# Altium project xmc-RG.PrjPCB
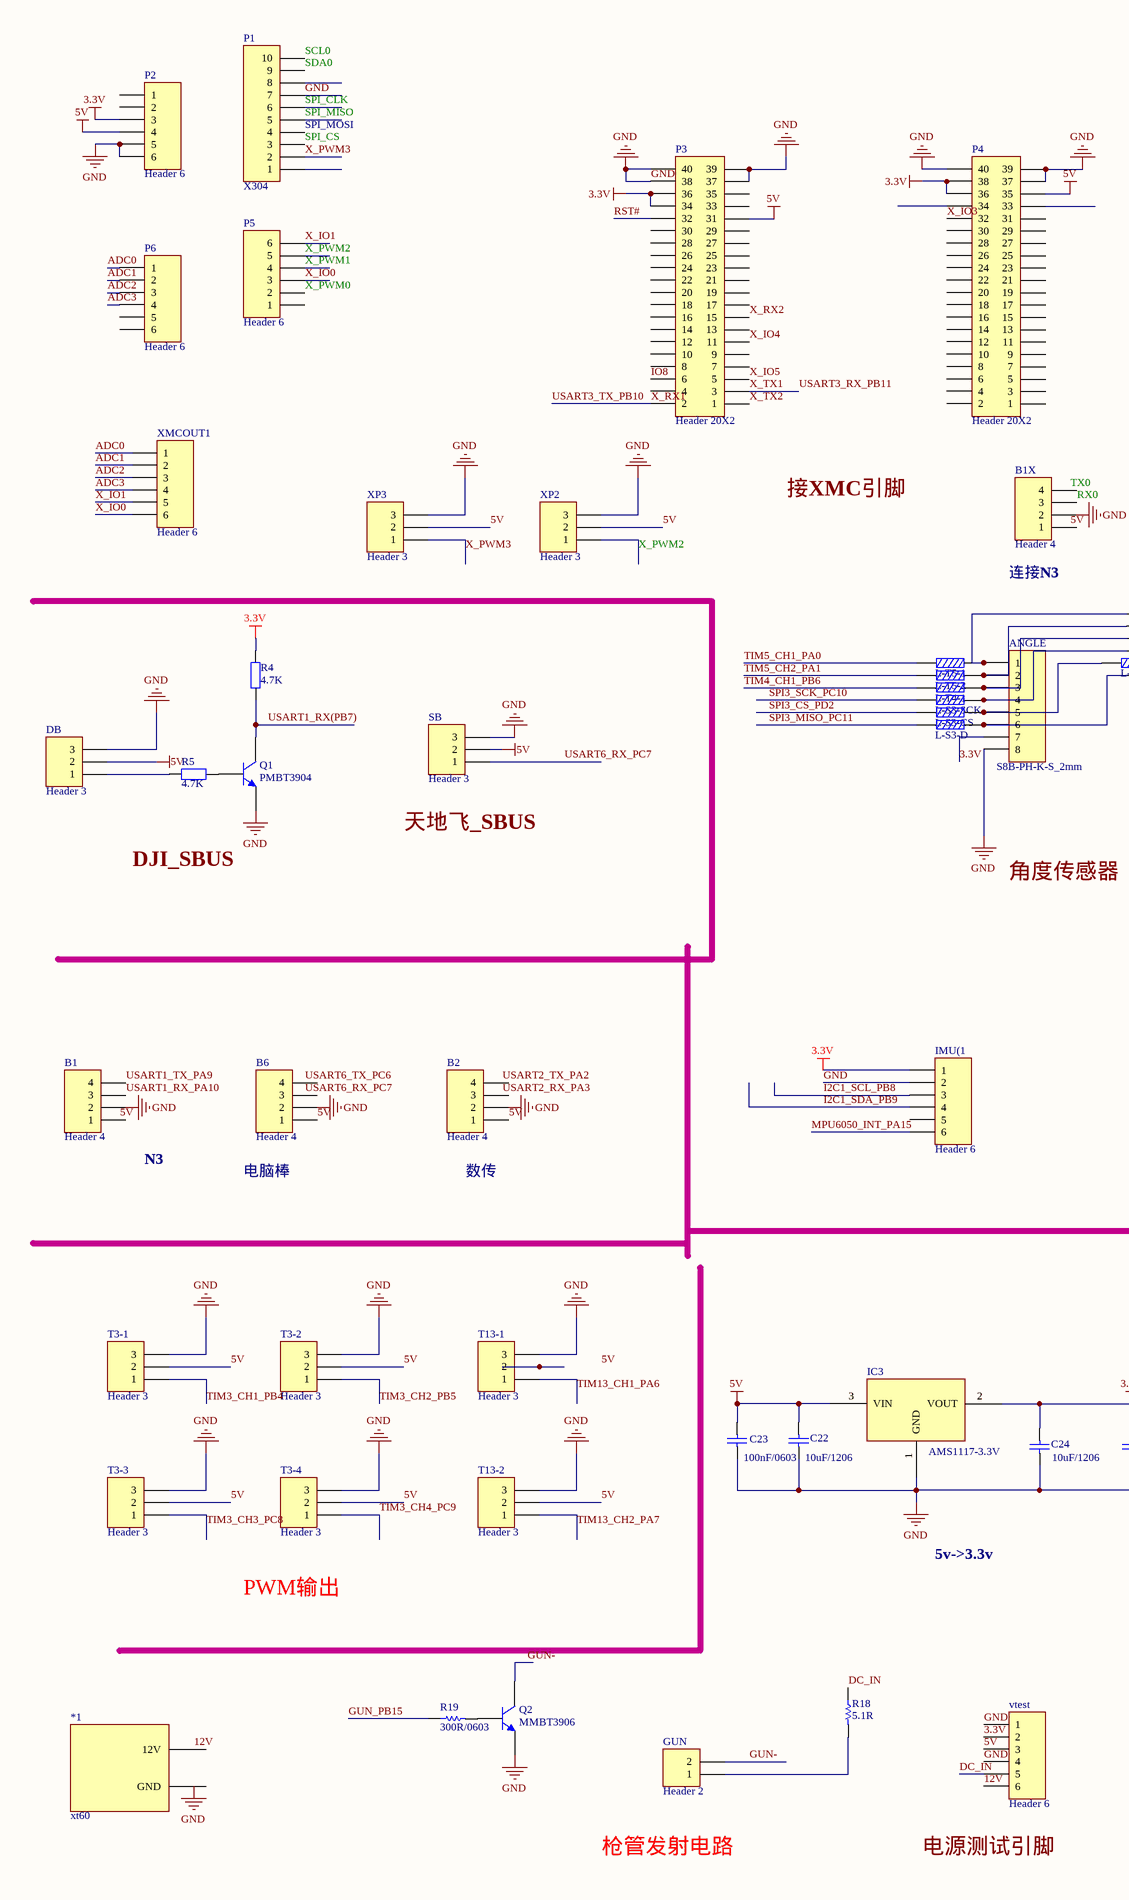
[diagram p0: XMCextern-RG-4_4.SchDoc, left]
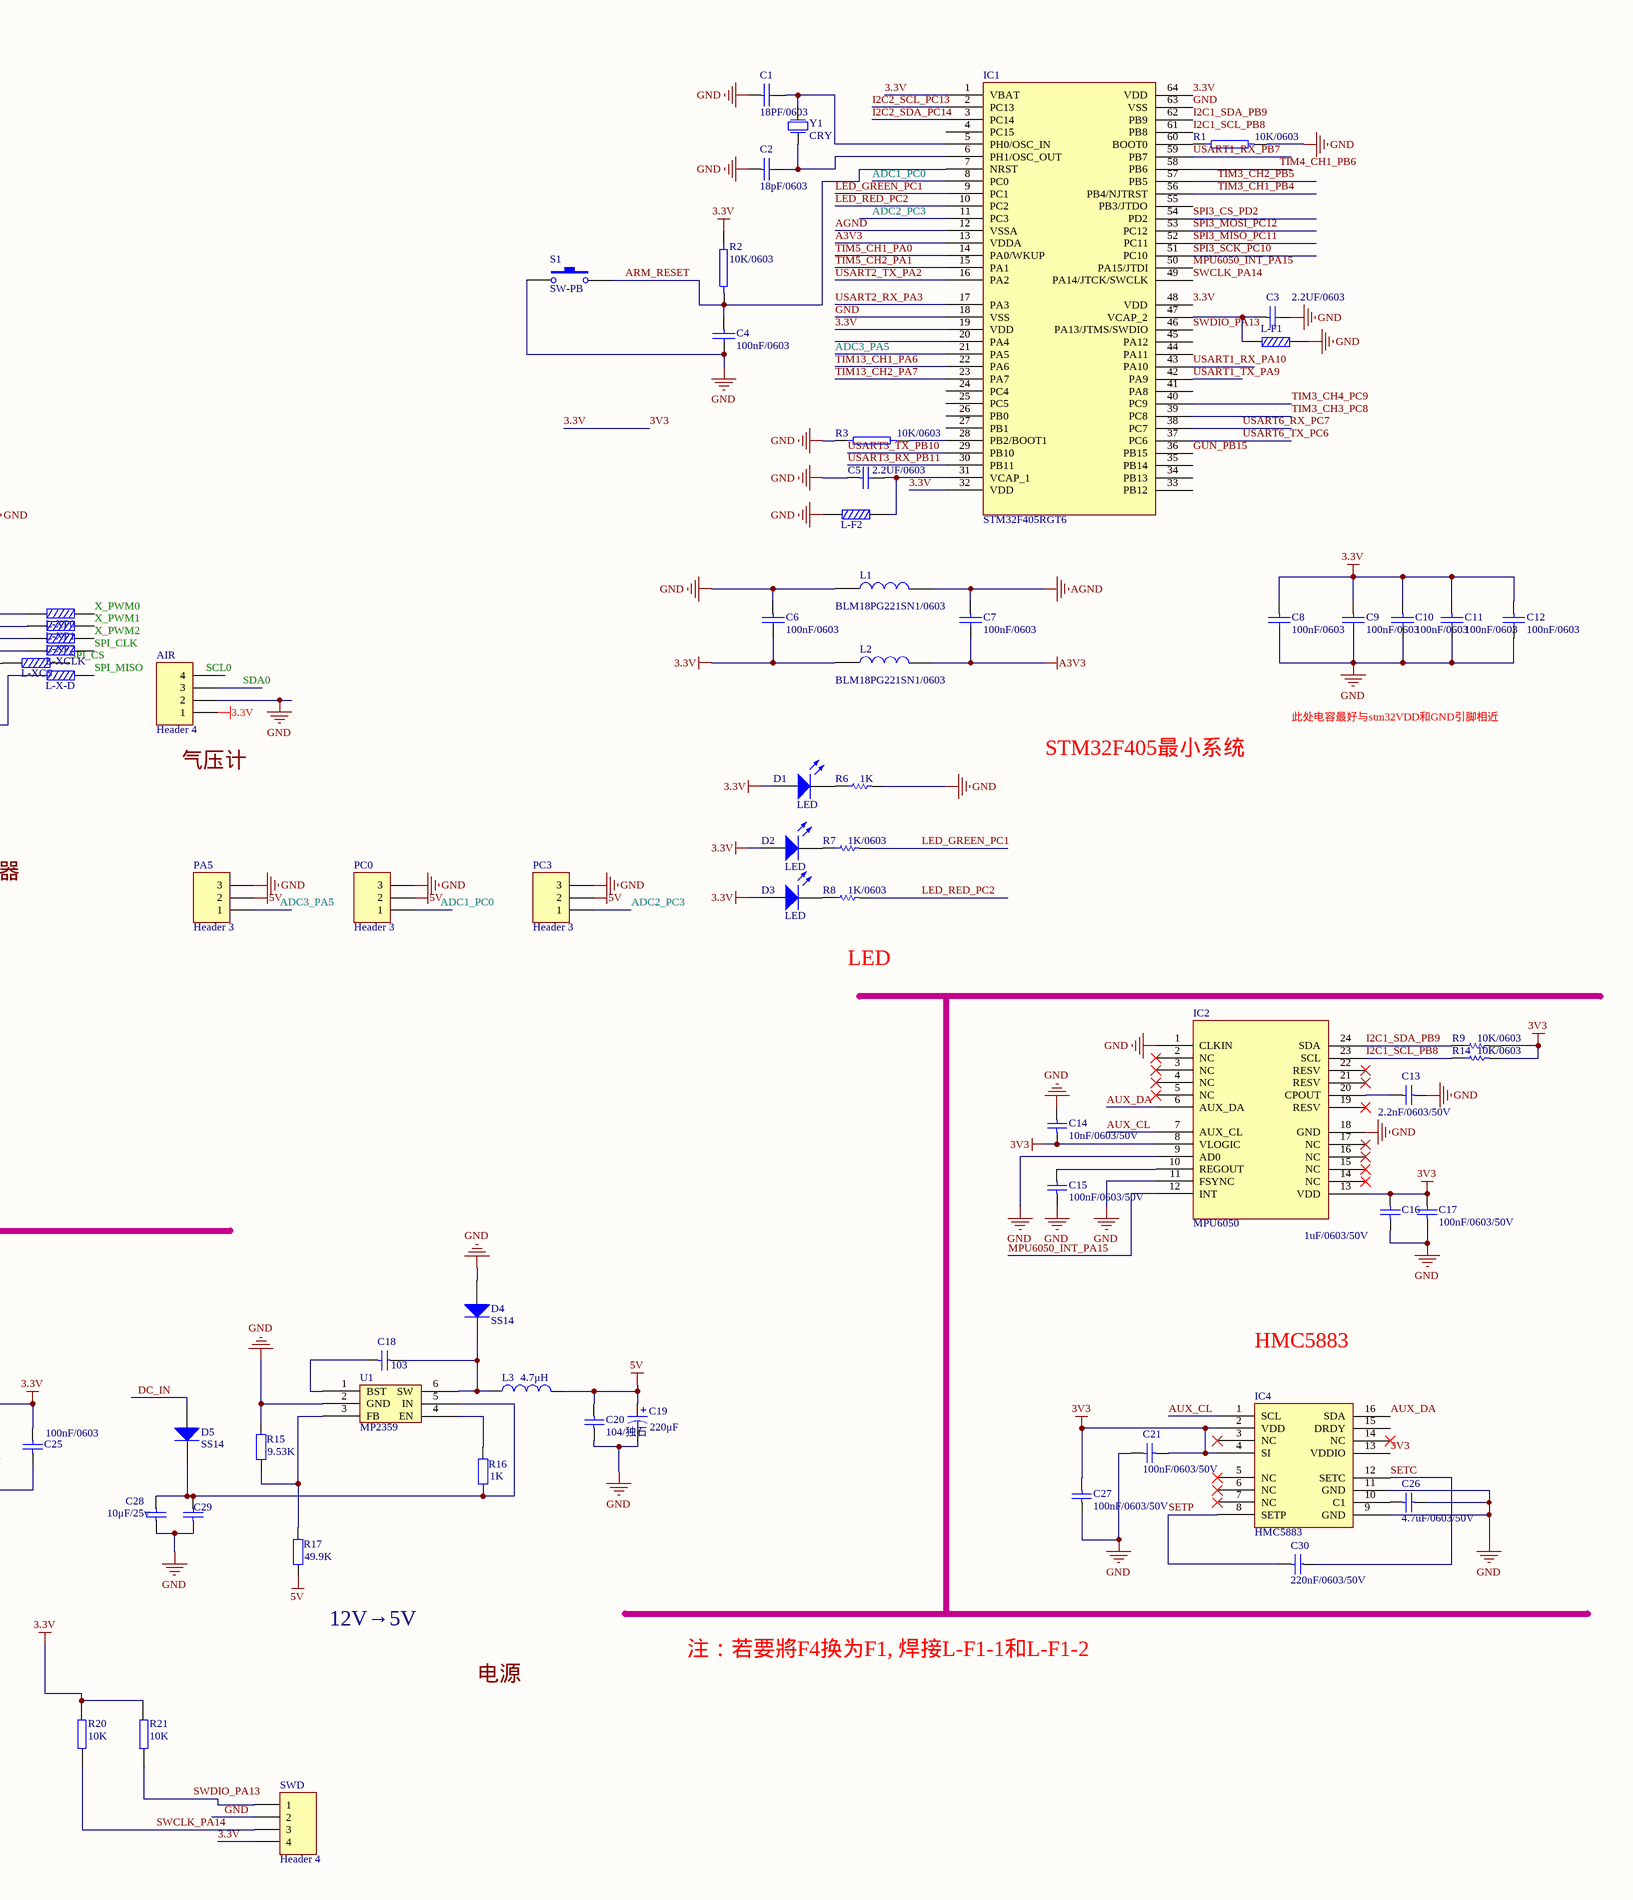
[diagram p1: XMCextern-RG-4_4.SchDoc, right]
1 sheet, 109 parts. Net scope: global (net labels, ports and power ports of the same name join across sheets).
Board file: XMC-RG.PcbDoc

## Sheet XMCextern-RG-4_4.SchDoc
size A2

### Parts
*1  xt60  [XT60]
AIR  Header 4  [HDR1X4]
ANGLE  S8B-PH-K-S_2mm  [PH_2MM_8PIN]
B1  Header 4  [HDR1X4]
B1X  Header 4  [HDR1X4]
B2  Header 4  [HDR1X4]
B6  Header 4  [HDR1X4]
C1  18PF/0603  [0603C]
C2  18pF/0603  [0603C]
C3  2.2UF/0603  [0603C]
C4  100nF/0603  [0603C]
C5  2.2UF/0603  [0603C]
C6  100nF/0603  [0603C]
C7  100nF/0603  [0603C]
C8  100nF/0603  [0603C]
C9  100nF/0603  [0603C]
C10  100nF/0603  [0603C]
C11  100nF/0603  [0603C]
C12  100nF/0603  [0603C]
C13  2.2nF/0603/50V  [0603C]
C14  10nF/0603/50V  [0603C]
C15  100nF/0603/50V  [0603C]
C16  1uF/0603/50V  [0603C]
C17  100nF/0603/50V  [0603C]
C18  value 103  [0805]  (hidden comment: Cap)
C19  220μF  [电解电容330uf，470uf]
C20  value 104/独石  [LC-0805_C]  (hidden comment: 104)
C21  100nF/0603/50V  [0603C]
C22  10uF/1206  [1206]
C23  100nF/0603  [0603]
C24  10uF/1206  [1206]
C25  100nF/0603  [0603]
C26  4.7uF/0603/50V  [0603C]
C27  100nF/0603/50V  [0603C]
C28  10μF/25v  [0805]
C29  Altium Limited  [0805]  (value not drawn)
C30  220nF/0603/50V  [0603C]
D1  LED  [0603D]
D2  LED  [0603D]
D3  LED  [0603D]
D4  SS14  [SS14]
D5  SS14  [SS14]
DB  Header 3  [HDR1X3]
GUN  Header 2  [HDR1X2]
IC1  STM32F405RGT6  [LQFP64_N]
IC2  MPU6050  [QFN-24N-MPU6050]  (no BOM)
IC3  AMS1117-3.3V  [SOT223-AMS1117]
IC4  HMC5883  [HMC5883]  (no BOM)
IMU(1  Header 6  [HDR1X6]  (no BOM)
L1  BLM18PG221SN1/0603  [0603L]
L2  BLM18PG221SN1/0603  [0603L]
L3  4.7μH  [4.7uh]
L-F1  L  [0805]  (value not drawn)  (no BOM)
L-F2  L  [0805]  (value not drawn)  (no BOM)
L-S3-CS  L  [0805]  (value not drawn)  (no BOM)
L-S3-D  L  [0805]  (value not drawn)  (no BOM)
L-S3-SCK  L  [0805]  (value not drawn)  (no BOM)
L-T4-1  L  [0805]  (value not drawn)  (no BOM)
L-T5-1  L  [0805]  (value not drawn)  (no BOM)
L-T5-2  L  [0805]  (value not drawn)  (no BOM)
L-X-D  L  [0805]  (value not drawn)  (no BOM)
L-XCLK  L  [0805]  (value not drawn)  (no BOM)
L-XCS  L  [0805]  (value not drawn)  (no BOM)
L-XP0  L  [0805]  (value not drawn)  (no BOM)
L-XP1  L  [0805]  (value not drawn)  (no BOM)
L-XP2  L  [0805]  (value not drawn)  (no BOM)
P1  X304  [HDR1X10]
P2  Header 6  [HDR1X6]
P3  Header 20X2  [HDR2X20]
P4  Header 20X2  [HDR2X20]
P5  Header 6  [HDR1X6]
P6  Header 6  [HDR1X6]
PA5  Header 3  [HDR1X3]
PC0  Header 3  [HDR1X3]
PC3  Header 3  [HDR1X3]
Q1  PMBT3904  [LC-SOT-23(SOT-23-3)]
Q2  MMBT3906  [sot23]
R1  10K/0603  [0603r]
R2  10K/0603  [0603R]
R3  10K/0603  [0603r]
R4  4.7K  [0603]
R5  4.7K  [0603]
R6  1K  [0603R]
R7  1K/0603  [0603R]
R8  1K/0603  [0603R]
R9  10K/0603  [0603]
R14  10K/0603  [0603]
R15  9.53K  [0805]
R16  1K  [0805]
R17  49.9K  [0805]
R18  5.1R  [0603]
R19  300R/0603  [0603]
R20  10K  [0805]
R21  10K  [0805]
S1  SW-PB  [SW_6*6*5]
SB  Header 3  [HDR1X3]
SWD  Header 4  [HDR1X4]  (no BOM)
T3-1  Header 3  [HDR1X3]
T3-2  Header 3  [HDR1X3]
T3-3  Header 3  [HDR1X3]
T3-4  Header 3  [HDR1X3]
T13-1  Header 3  [HDR1X3]
T13-2  Header 3  [HDR1X3]
U1  MP2359  [mp2359]
vtest  Header 6  [HDR1X6]
XMCOUT1  Header 6  [HDR1X6]  (no BOM)
XP2  Header 3  [HDR1X3]
XP3  Header 3  [HDR1X3]
Y1  CRY  [XTAL_5032]

### Nets
3.3V: AIR.1 ANGLE.7 C6.2 C8.1 C9.1 C10.1 C11.1 C12.1 C14.1 C16.2 C17.2 C21.2 C24.2 C25.2 C27.2 D1.1(A) D2.1(A) D3.1(A) IC1.1(VBAT) IC1.19(VDD) IC1.32(VDD) IC1.48(VDD) IC1.64(VDD) IC2.8(VLOGIC) IC2.13(VDD) IC3.2(VOUT) IC4.2(VDD) IC4.4(SI) IC4.13(VDDIO) IMU(1.1 L2.1 P2.3 P3.34 P3.36 P4.36 P4.38 R2.2 R4.1 R9.2 R14.2 R20.2 R21.2 SWD.4 vtest.2  [also labelled 3V3]
5V: B2.1 B6.1 C19.1 C20.1 C22.2 C23.2 DB.2 IC3.3(VIN) L3.2 P2.4 P3.31 P4.35 PA5.2 PC0.2 PC3.2 R17.1 SB.2 T3-1.2 T3-2.2 T3-3.2 T3-4.2 T13-2.2 vtest.3 XP2.2 XP3.2
A3V3: C7.2 IC1.13(VDDA) L2.2
AGND: C7.1 IC1.12(VSSA) L1.2
GND: AIR.2 ANGLE.8 B1.2 B1X.2 B2.2 B6.2 C1.1 C2.1 C3.2 C4.2 C5.1 C6.1 C8.2 C9.2 C10.2 C11.2 C12.2 C13.2 C14.2 C15.1 C16.1 C17.1 C19.2 C20.2 C21.1 C22.1 C23.1 C24.1 C25.1 C26.2 C27.1 C28.2 C29.2 D4.1(A) DB.3 IC1.18(VSS) IC1.63(VSS) IC2.1(CLKIN) IC2.9(AD0) IC2.11(FSYNC) IC2.18(GND) IC3.1(GND) IC4.9(GND) IC4.11(GND) IMU(1.2 L1.1 L-F1.2 L-F2.2 P1.7 P2.5 P2.6 P3.37 P3.38 P3.39 P3.40 P4.37 P4.39 P4.40 PA5.3 PC0.3 PC3.3 Q1.3(E) Q2.2(E) R1.1 R3.2 R6.2 R15.2 S1.1 SB.3 SWD.2 T3-1.3 T3-2.3 T3-3.3 T3-4.3 T13-1.3 T13-2.3 U1.2(GND) vtest.1 vtest.4 XP2.3 XP3.3
12V: vtest.6
ADC0: P6.1 XMCOUT1.1
ADC1: P6.2 XMCOUT1.2
ADC1_PC0: IC1.8(PC0) PC0.1
ADC2: P6.3 XMCOUT1.3
ADC2_PC3: IC1.11(PC3) PC3.1
ADC3: P6.4 XMCOUT1.4
ADC3_PA5: IC1.21(PA5) PA5.1
ARM_RESET: C4.1 IC1.7(NRST) R2.1 S1.2
AUX_CL: IC2.7(AUX_CL) IC4.1(SCL)
AUX_DA: IC2.6(AUX_DA) IC4.16(SDA)
DC_IN: D5.1(A) R18.1 vtest.5
GUN-: GUN.2 Q2.3(C)
GUN_PB15: IC1.36(PB15) R19.1
I2C1_SCL_PB8: IC1.61(PB8) IC2.23(SCL) IMU(1.3 R14.1
I2C1_SDA_PB9: IC1.62(PB9) IC2.24(SDA) IMU(1.4 R9.1
I2C2_SCL_PC13: IC1.2(PC13)
I2C2_SDA_PC14: IC1.3(PC14)
IO8: P3.6
LED_GREEN_PC1: IC1.9(PC1) R7.2
LED_RED_PC2: IC1.10(PC2) R8.2
MPU6050_INT_PA15: IC1.50(PA15/JTDI) IC2.12(INT) IMU(1.6
RST#: P3.32
RX0: B1X.3
SCL0: P1.10
SDA0: AIR.3 P1.9
SETC: C30.2 IC4.12(SETC)
SETP: C30.1 IC4.8(SETP)
SPI3_CS_PD2: IC1.54(PD2) L-S3-CS.2
SPI3_MISO_PC11: IC1.52(PC11) L-S3-D.2
SPI3_MOSI_PC12: IC1.53(PC12)
SPI3_SCK_PC10: IC1.51(PC10) L-S3-SCK.2
SPI_CLK: L-XCLK.1 P1.6
SPI_CS: L-XCS.1 P1.3
SPI_MISO: L-X-D.1 P1.5
SPI_MOSI: P1.4
SWCLK_PA14: IC1.49(PA14/JTCK/SWCLK) R20.1 SWD.3
SWDIO_PA13: IC1.46(PA13/JTMS/SWDIO) R21.1 SWD.1
TIM3_CH1_PB4: IC1.56(PB4/NJTRST) T3-1.1
TIM3_CH2_PB5: IC1.57(PB5) T3-2.1
TIM3_CH3_PC8: IC1.39(PC8) T3-3.1
TIM3_CH4_PC9: IC1.40(PC9) T3-4.1
TIM4_CH1_PB6: IC1.58(PB6) L-T4-1.2
TIM5_CH1_PA0: IC1.14(PA0/WKUP) L-T5-1.2
TIM5_CH2_PA1: IC1.15(PA1) L-T5-2.2
TIM13_CH1_PA6: IC1.22(PA6) T13-1.1
TIM13_CH2_PA7: IC1.23(PA7) T13-2.1
USART1_RX(PB7): Q1.1(C) R4.2
USART1_RX_PA10: B1.3 IC1.43(PA10)
USART1_RX_PB7: IC1.59(PB7)
USART1_TX_PA9: B1.4 IC1.42(PA9)
USART2_RX_PA3: IC1.17(PA3)
USART2_TX_PA2: IC1.16(PA2)
USART3_RX_PB11: IC1.30(PB11) P3.3  [also labelled X_TX1]
USART3_TX_PB10: IC1.29(PB10) P3.2  [also labelled X_RX1]
USART6_RX_PC7: IC1.38(PC7) SB.1
USART6_TX_PC6: IC1.37(PC6)
X_IO0: P5.3 XMCOUT1.6
X_IO1: P5.6 XMCOUT1.5
X_IO3: P4.32
X_IO4: P3.11
X_IO5: P3.5
X_PWM0: L-XP0.1 P5.2
X_PWM1: L-XP1.1 P5.4
X_PWM2: L-XP2.1 P5.5 XP2.1
X_PWM3: P1.2 XP3.1
X_RX2: P3.15
X_TX2: P3.1
NetANGLE_1: ANGLE.1 L-T5-1.1 L-XP0.2
NetANGLE_2: ANGLE.2 L-T5-2.1 L-XP1.2
NetANGLE_3: ANGLE.3 L-T4-1.1 L-XP2.2
NetANGLE_4: ANGLE.4 L-S3-SCK.1 L-XCLK.2
NetANGLE_5: ANGLE.5 L-S3-CS.1 L-XCS.2
NetANGLE_6: ANGLE.6 L-S3-D.1 L-X-D.2
NetC1_2: C1.2 IC1.5(PH0/OSC_IN) Y1.2(P2)
NetC2_2: C2.2 IC1.6(PH1/OSC_OUT) Y1.1(P1)
NetC3_1: C3.1 IC1.47(VCAP_2) L-F1.1
NetC5_2: C5.2 IC1.31(VCAP_1) L-F2.1
NetC13_1: C13.1 IC2.20(CPOUT)
NetC15_2: C15.2 IC2.10(REGOUT)
NetC18_1: C18.1 D4.2(K) L3.1 U1.6(SW)
NetC18_2: C18.2 U1.1(BST)
NetC26_1: C26.1 IC4.10(C1)
NetC28_1: C28.1 C29.1 D5.2(K) R16.1 U1.5(IN)
NetD1_2: D1.2(K) R6.1
NetD2_2: D2.2(K) R7.1
NetD3_2: D3.2(K) R8.1
NetDB_1: DB.1 R5.1
NetGUN_1: GUN.1 R18.2
NetIC1_28: IC1.28(PB2/BOOT1) R3.1
NetIC1_60: IC1.60(BOOT0) R1.2
NetQ1_2: Q1.2(B) R5.2
NetQ2_1: Q2.1(B) R19.2
NetR15_1: R15.1 R17.2 U1.3(FB)
NetR16_2: R16.2 U1.4(EN)

Not connected (* = marked no-connect by the designer): *1 46(12V) 47(GND); AIR 4; B1 1; B1X 1 4; B2 3 4; B6 3 4; IC1 4(PC15) 20(PA4) 24(PC4) 25(PC5) 26(PB0) 27(PB1) 33(PB12) 34(PB13) 35(PB14) 41(PA8) 44(PA11) 45(PA12) 55(PB3/JTDO); IC2 2(NC)* 3(NC)* 4(NC)* 5(NC)* 14(NC)* 15(NC)* 16(NC)* 17(NC)* 19(RESV)* 21(RESV)* 22(RESV)*; IC4 3(NC)* 5(NC)* 6(NC)* 7(NC)* 14(NC)* 15(DRDY); IMU(1 5; P1 1 8; P2 1 2; P3 4 7 8 9 10 12 13 14 16 17 18 19 20 21 22 23 24 25 26 27 28 29 30 33 35; P4 1 2 3 4 5 6 7 8 9 10 11 12 13 14 15 16 17 18 19 20 21 22 23 24 25 26 27 28 29 30 31 33 34; P5 1; P6 5 6; T13-1 2

### Notes on the sheet
- 接XMC引脚
- (near B1X) 连接N3
- (near AIR) 气压计
- STM32F405最小系统
- 此处电容最好与stm32VDD和GND引脚相近
- 天地飞_SBUS
- DJI_SBUS
- 角度传感器
- LED
- N3
- 电脑棒
- (near B2) 数传
- HMC5883
- 5v->3.3v
- PWM输出
- 12V→5V
- 电源
- 注：若要將F4换为F1, 焊接L-F1-1和L-F1-2
- 枪管发射电路
- 电源测试引脚
- Labels drawn without touching a wire or pin: 5V, 12V, GND, SCL0, TX0, USART2_RX_PA3, USART2_TX_PA2, USART6_RX_PC7, USART6_TX_PC6
- Title
- Size:
- Date:
- File:
- A2
- Number:
- Time:
- Revision:
- Sheet
- of

### Library data of the parts
AIR B1 B1X B2 B6 SWD = Header 4: Header, 4-Pin; LatestRevisionDate: 17-Jul-2002; LatestRevisionNote: Re-released for DXP Platform.; Publisher: Altium Limited
ANGLE = MHDR1X8: Header, 8-Pin; LatestRevisionDate: 17-Jul-2002; LatestRevisionNote: Re-released for DXP Platform.; Publisher: Altium Limited
C1-C12 = CAP1
C13-C17 C21-C27 C30 = Cap: Capacitor; Value: 100pF; Published: 8-Jun-2000; LatestRevisionDate: 17-Jul-2002; LatestRevisionNote: Re-released for DXP Platform.; PackageReference: RAD-0.3; Publisher: Altium Limited; PackageDescription: Radial Cap, Thru-Hole; 2 Leads; 0.3 in Pin Spacing
C18 C20 C28 C29 = Cap: Capacitor; Published: 8-Jun-2000; LatestRevisionDate: 17-Jul-2002; LatestRevisionNote: Re-released for DXP Platform.; PackageReference: RAD-0.3; Publisher: Altium Limited
  C28: Value: 10μF/25v
C19 = Cap Pol1: Polarized Capacitor (Radial); Published: 8-Jun-2000; LatestRevisionDate: 17-Jul-2002; LatestRevisionNote: Re-released for DXP Platform.; PackageReference: RB7.6-15; Publisher: Altium Limited; Value: 220μF
D1-D3 = LED2: Typical RED, GREEN, YELLOW, AMBER GaAs LED; Published: 8-Jun-2000; LatestRevisionDate: 17-Jul-2002; LatestRevisionNote: Re-released for DXP Platform.; PackageVersion: Feb-2002; PackageReference: 3.2X1.6X1.1; Publisher: Altium Limited; PackageDescription: SM LED; 2 Flat Leads
D4 D5 = Diode: Default Diode; Published: 8-Jun-2000; LatestRevisionDate: 17-Jul-2002; LatestRevisionNote: Re-released for DXP Platform.; PackageDocument: Sep-1996; PackageReference: SMC; Publisher: Altium Limited; Code_JEDEC: DO-214-AB
DB PA5 PC0 PC3 SB T3-1-T3-4 T13-1 T13-2 XP2 XP3 = Header 3: Header, 3-Pin; LatestRevisionDate: 17-Jul-2002; LatestRevisionNote: Re-released for DXP Platform.; Publisher: Altium Limited
GUN = Header 2: Header, 2-Pin; LatestRevisionDate: 17-Jul-2002; LatestRevisionNote: Re-released for DXP Platform.; Publisher: Altium Limited
IMU(1 P2 P5 P6 vtest XMCOUT1 = Header 6: Header, 6-Pin; LatestRevisionDate: 17-Jul-2002; LatestRevisionNote: Re-released for DXP Platform.; Publisher: Altium Limited
L1 L2 = INDUCTOR1
L3 = Inductor: Code_IEC: 1005; Published: 8-Jun-2000; LatestRevisionDate: 17-Jul-2002; LatestRevisionNote: Re-released for DXP Platform.; PackageReference: 0402-A; Publisher: Altium Limited; Code_JEITA: 0402; Value: 4.7μH
P1 = Header 10: Header, 10-Pin; LatestRevisionDate: 17-Jul-2002; LatestRevisionNote: Re-released for DXP Platform.; Publisher: Altium Limited
P3 P4 = Header 20X2: Header, 20-Pin, Dual row; LatestRevisionDate: 17-Jul-2002; LatestRevisionNote: Re-released for DXP Platform.; Publisher: Altium Limited
Q1 = NPN: NPN Bipolar Transistor; Published: 8-Jun-2000; LatestRevisionDate: 17-Jul-2002; LatestRevisionNote: Re-released for DXP Platform.; PackageReference: TO-226-AA; Publisher: Altium Limited; PackageDescription: TO, Flat Index; 3 In-Line, Axial Leads; Body Dia. 4.8mm; Leads 0.55 x 0.51 mm (max); Code_JEDEC: TO-226-AA
Q2 = 2N3904: Published: 8-Jun-2000; LatestRevisionDate: 15-Jan-2003; LatestRevisionNote: PCB Footprint 'BCY-W3/D4.7' replaced; DatasheetVersion: 1997; PackageVersion: Sep-1998; PackageReference: TO-92A; Publisher: Altium Limited; PackageDescription: TO, Flat Index; 3 In-Line, Axial Leads; Body Dia. 4.5mm; Leads 0.51 x 0.48 mm (max); ComponentLink1Description: Manufacturer Link; ComponentLink1URL: http://www.fairchildsemi.com/; ComponentLink2Description: Datasheet; ComponentLink2URL: http://www.fairchildsemi.com/ds/2N%2F2N3904.pdf
R1-R3 = RES
R4 R5 = Res2: Resistor; Value: 4K7; Published: 8-Jun-2000; LatestRevisionDate: 17-Jul-2002; LatestRevisionNote: Re-released for DXP Platform.; PackageReference: AXIAL-0.4; Publisher: Altium Limited; PackageDescription: Axial Device, Thru-Hole; 2 Leads; 0.4 in Pin Spacing
R6 = Res1: Resistor; Published: 8-Jun-2000; LatestRevisionDate: 17-Jul-2002; LatestRevisionNote: Re-released for DXP Platform.; PackageReference: AXIAL-0.3; Publisher: Altium Limited; PackageDescription: Axial Device, Thru-Hole; 2 Leads; 0.3 in Pin Spacing; Value: 1K
R7-R9 R14 R18 R19 = Res1: Resistor; Value: 1K; Published: 8-Jun-2000; LatestRevisionDate: 17-Jul-2002; LatestRevisionNote: Re-released for DXP Platform.; PackageReference: AXIAL-0.3; Publisher: Altium Limited; PackageDescription: Axial Device, Thru-Hole; 2 Leads; 0.3 in Pin Spacing
R15-R17 = Res2: Resistor; Published: 8-Jun-2000; LatestRevisionDate: 17-Jul-2002; LatestRevisionNote: Re-released for DXP Platform.; PackageReference: AXIAL-0.4; Publisher: Altium Limited
  R15: Value: 9.53K
  R16: Value: 1K
  R17: Value: 49.9K
R20 R21 = R
S1 = SW-PB: Switch; Published: 24-Mar-1999; LatestRevisionDate: 17-Jul-2002; LatestRevisionNote: Re-released for DXP Platform.; PackageReference: SPST-2; Publisher: Altium Limited